# EAGLE schematic 4ButtonSwitch.Rev2.1 (EAGLE 8.6.0)
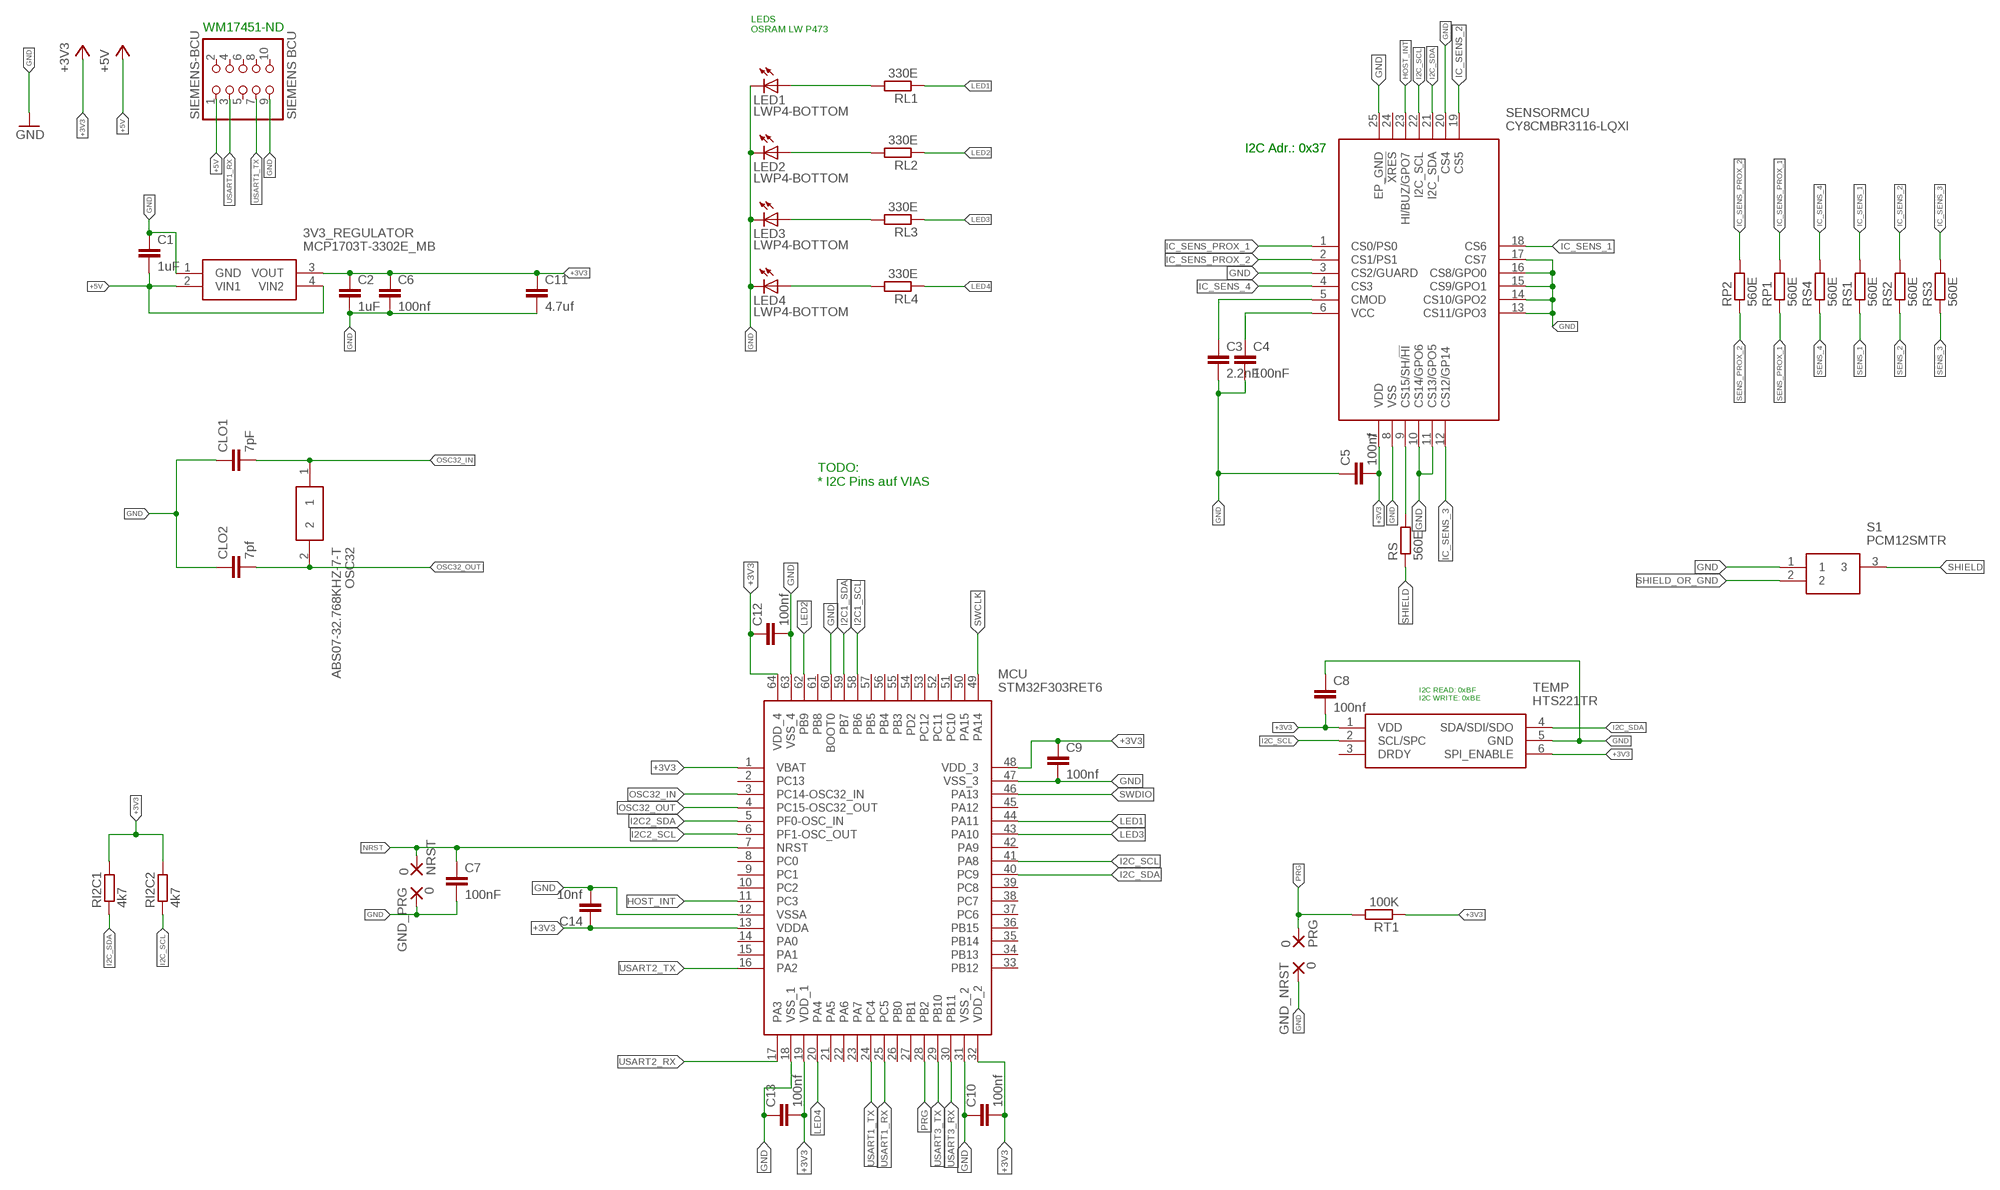
[diagram p0: schematic, sheet 1]

## Parts
3V3_REGULATOR  MCP1703T-3302E_MB  [SOT-89(MB)]
C1  1uF  C-EUC0402  [C0402]
C2  1uF  C-EUC0402  [C0402]
C3  2.2nF  C-EUC0402  [C0402]
C4  100nF  C-EUC0402  [C0402]
C5  100nf  C-EUC0402  [C0402]
C6  100nf  C-EUC0402  [C0402]
C7  100nF  C-EUC0402  [C0402]
C8  100nf  C-EUC0402  [C0402]
C9  100nf  C-EUC0402  [C0402]
C10  100nf  C-EUC0402  [C0402]
C11  4.7uf  C-EUC0402  [C0402]
C12  100nf  C-EUC0402  [C0402]
C13  100nf  C-EUC0402  [C0402]
C14  10nf  C-EUC0402  [C0402]
CLO1  7pF  C-EUC0402  [C0402]
CLO2  7pf  C-EUC0402  [C0402]
GND_NRST  0  SMD5  [SMD2,54-5,08]
GND_PRG  0  SMD5  [SMD2,54-5,08]
LED1  LWP4-BOTTOM  [P47F-BOTTOM]
LED2  LWP4-BOTTOM  [P47F-BOTTOM]
LED3  LWP4-BOTTOM  [P47F-BOTTOM]
LED4  LWP4-BOTTOM  [P47F-BOTTOM]
MCU  STM32F303RET6  [QFP50P1200X1200X160-64N]
NRST  0  SMD5  [SMD2,54-5,08]
OSC32  ABS07-32.768KHZ-7-T  [ABS-07]
PRG  0  SMD5  [SMD2,54-5,08]
RI2C1  4k7  R-EU_R0402  [R0402]
RI2C2  4k7  R-EU_R0402  [R0402]
RL1  330E  R-EU_R0402  [R0402]
RL2  330E  R-EU_R0402  [R0402]
RL3  330E  R-EU_R0402  [R0402]
RL4  330E  R-EU_R0402  [R0402]
RP1  560E  R-EU_R0402  [R0402]
RP2  560E  R-EU_R0402  [R0402]
RS  560E  R-EU_R0402  [R0402]
RS1  560E  R-EU_R0402  [R0402]
RS2  560E  R-EU_R0402  [R0402]
RS3  560E  R-EU_R0402  [R0402]
RS4  560E  R-EU_R0402  [R0402]
RT1  100K  R-EU_R0402  [R0402]
S1  PCM12SMTR  [PCM12SMTR_1]
SENSORMCU  CY8CMBR3116-LQXI  [QFN50P400X400X60-25N]
SIEMENS-BCU  SIEMENS BCU  PINHD-2X5_2.54-SMD  [2X05SMD]
TEMP  HTS221TR  [HLGA-6L]

## Nets
+3V3: 3V3_REGULATOR.3(VOUT) C2.1 C5.2 C6.1 C8.2 C9.1 C10.2 C11.1 C12.1 C13.2 C14.1 MCU.1(VBAT) MCU.13(VDDA) MCU.19(VDD_1) MCU.32(VDD_2) MCU.48(VDD_3) MCU.64(VDD_4) RI2C1.2 RI2C2.2 RT1.1 SENSORMCU.7(VDD) TEMP.1(VDD) TEMP.6(SPI_ENABLE)
+5V: 3V3_REGULATOR.2(VIN1) 3V3_REGULATOR.4(VIN2) C1.2 SIEMENS-BCU.1
CMOD: C3.1 SENSORMCU.5(CMOD)
GND: 3V3_REGULATOR.1(GND) C1.1 C2.2 C3.2 C4.2 C5.1 C6.2 C7.2 C8.1 C9.2 C10.1 C11.2 C12.2 C13.1 C14.2 CLO1.1 CLO2.1 GND_NRST.1(P) GND_PRG.1(P) LED1.C LED2.C LED3.C LED4.C MCU.12(VSSA) MCU.18(VSS_1) MCU.31(VSS_2) MCU.47(VSS_3) MCU.60(BOOT0) MCU.63(VSS_4) S1.1 SENSORMCU.3(CS2/GUARD) SENSORMCU.8(VSS) SENSORMCU.10(CS14/GPO6) SENSORMCU.11(CS13/GPO5) SENSORMCU.13(CS11/GPO3) SENSORMCU.14(CS10/GPO2) SENSORMCU.15(CS9/GPO1) SENSORMCU.16(CS8/GPO0) SENSORMCU.17(CS7) SENSORMCU.20(CS4) SENSORMCU.25(EP_GND) SIEMENS-BCU.9 TEMP.5(GND)
HOST_INT: MCU.11(PC3) SENSORMCU.23(HI/BUZ/GPO7)
I2C1_SCL: MCU.58(PB6)
I2C1_SDA: MCU.59(PB7)
I2C2_SCL: MCU.6(PF1-OSC_OUT)
I2C2_SDA: MCU.5(PF0-OSC_IN)
I2C_SCL: MCU.41(PA8) RI2C2.1 SENSORMCU.22(I2C_SCL) TEMP.2(SCL/SPC)
I2C_SDA: MCU.40(PC9) RI2C1.1 SENSORMCU.21(I2C_SDA) TEMP.4(SDA/SDI/SDO)
IC_SENS_1: RS1.2 SENSORMCU.18(CS6)
IC_SENS_2: RS2.2 SENSORMCU.19(CS5)
IC_SENS_3: RS3.2 SENSORMCU.12(CS12/GP14)
IC_SENS_4: RS4.2 SENSORMCU.4(CS3)
IC_SENS_PROX_1: RP1.2 SENSORMCU.1(CS0/PS0)
IC_SENS_PROX_2: RP2.2 SENSORMCU.2(CS1/PS1)
LED1: MCU.44(PA11) RL1.1
LED2: MCU.62(PB9) RL2.1
LED3: MCU.43(PA10) RL3.1
LED4: MCU.20(PA4) RL4.1
N$1: RS.2 SENSORMCU.9(CS15/SH/!HI)
N$19: LED1.A RL1.2
N$20: LED2.A RL2.2
N$21: LED3.A RL3.2
N$22: LED4.A RL4.2
NRST: C7.1 MCU.7(NRST) NRST.1(P)
OSC32_IN: CLO1.2 MCU.3(PC14-OSC32_IN) OSC32.1
OSC32_OUT: CLO2.2 MCU.4(PC15-OSC32_OUT) OSC32.2
PRG: MCU.28(PB2) PRG.1(P) RT1.2
SENS_1: RS1.1
SENS_2: RS2.1
SENS_3: RS3.1
SENS_4: RS4.1
SENS_PROX_1: RP1.1
SENS_PROX_2: RP2.1
SHIELD: RS.1 S1.3
SHIELD_OR_GND: S1.2
SWCLK: MCU.49(PA14)
SWDIO: MCU.46(PA13)
USART1_RX: MCU.25(PC5) SIEMENS-BCU.3
USART1_TX: MCU.24(PC4) SIEMENS-BCU.7
USART2_RX: MCU.17(PA3)
USART2_TX: MCU.16(PA2)
USART3_RX: MCU.30(PB11)
USART3_TX: MCU.29(PB10)
VCC: C4.1 SENSORMCU.6(VCC)
Unconnected: MCU.2(PC13) MCU.8(PC0) MCU.9(PC1) MCU.10(PC2) MCU.14(PA0) MCU.15(PA1) MCU.21(PA5) MCU.22(PA6) MCU.23(PA7) MCU.26(PB0) MCU.27(PB1) MCU.33(PB12) MCU.34(PB13) MCU.35(PB14) MCU.36(PB15) MCU.37(PC6) MCU.38(PC7) MCU.39(PC8) MCU.42(PA9) MCU.45(PA12) MCU.50(PA15) MCU.51(PC10) MCU.52(PC11) MCU.53(PC12) MCU.54(PD2) MCU.55(PB3) MCU.56(PB4) MCU.57(PB5) MCU.61(PB8) SENSORMCU.24(!XRES) SIEMENS-BCU.2 SIEMENS-BCU.4 SIEMENS-BCU.5 SIEMENS-BCU.6 SIEMENS-BCU.8 SIEMENS-BCU.10 TEMP.3(DRDY)

## Notes on the sheet
- LEDS
  OSRAM LW P473
- WM17451-ND
- I2C Adr.: 0x37 | I2C Adr.: 0x37
- TODO:
  * I2C Pins auf VIAS
- I2C READ: 0xBF
  I2C WRITE: 0xBE

## Library data of the parts
3V3_REGULATOR = MCP1703T-3302E_MB:MCP1703T-3302E_MB: LDO Low Iq 250mA 16V 3.3V 2% SOT89 Microchip MCP1703T-3302E/MB, LDO Voltage Regulator, 250mA, 3.3 V 2%, 2.7 16 Vin, 3-Pin SOT-89 Source: Datasheet <http://ww1.microchip.com/downloads/en/DeviceDoc/22049f.pdf>; ALLIED_NUMBER: 70047986; ALLIED_PRICE/STOCK: https://www.alliedelec.com/microchip-technology-inc-mcp1703t-3302e-mb/70047986/; ARROW_PART_NUMBER: MCP1703T-3302E/MB; ARROW_PRICE/STOCK: https://www.arrow.com/en/products/mcp1703t-3302emb/microchip-technology; DESCRIPTION: LDO Low Iq 250mA 16V 3.3V 2% SOT89 Microchip MCP1703T-3302E/MB, LDO Voltage Regulator, 250mA, 3.3 V 2%, 2.7 16 Vin, 3-Pin SOT-89; HEIGHT: mm; MANUFACTURER_NAME: Microchip; MANUFACTURER_PART_NUMBER: MCP1703T-3302E/MB; RS_PART_NUMBER: 9122916; RS_PRICE/STOCK: http://uk.rs-online.com/web/p/products/9122916
C1-C14 CLO1 CLO2 = rcl:C-EU: CAPACITOR, European symbol; SPICEPREFIX: C
GND_NRST GND_PRG NRST PRG = wirepad:SMD5: SMD PAD
LED1-LED4 = led:*P4: PointLED® Enhanced Thinfilm LED TOP & BOTTOM mount LS P47F, LR P47F, LA P47F, LY P47F, LT P4SG, LB P4SG, LW P4SG Source: http://catalog.osram-os.com .. LA_LR_LS_LY_P47F_Pb_free.pdf
MCU = STM32F303RET6:STM32F303RET6: MCU+FPU 32-Bit Cortex-M4 512KB LQFP64 Source: Datasheet <http://www.st.com/content/ccc/resource/technical/document/datasheet/2c/6f/d7/64/1f/a3/4f/c9/DM00118585.pdf/files/DM00118585.pdf/jcr:content/translations/en.DM00118585.pdf>; ARROW_PART_NUMBER: STM32F303RET6; ARROW_PRICE/STOCK: https://www.arrow.com/en/products/stm32f303ret6/stmicroelectronics; DESCRIPTION: MCU+FPU 32-Bit Cortex-M4 512KB LQFP64; HEIGHT: 1.6mm; MANUFACTURER_NAME: STMicroelectronics; MANUFACTURER_PART_NUMBER: STM32F303RET6; RS_PART_NUMBER: 1458887; RS_PRICE/STOCK: http://uk.rs-online.com/web/p/products/1458887
OSC32 = ABS07-32.768KHZ-7-T:ABS07-32.768KHZ-7-T: ABRACON - ABS07-32.768KHZ-7-T - CRYSTAL, 32.768KHZ, 7PF, SMD Source: Datasheet <https://componentsearchengine.com/Datasheets/2/ABS07-32.768KHZ-7-T.pdf>; ARROW_PART_NUMBER: ABS07-32.768KHZ-7-T; ARROW_PRICE/STOCK: https://www.arrow.com/en/products/abs07-32.768khz-7-t/abracon; DESCRIPTION: ABRACON - ABS07-32.768KHZ-7-T - CRYSTAL, 32.768KHZ, 7PF, SMD; HEIGHT: mm; MANUFACTURER_NAME: ABRACON; MANUFACTURER_PART_NUMBER: ABS07-32.768KHZ-7-T; RS_PART_NUMBER: 1712773P; RS_PRICE/STOCK: http://uk.rs-online.com/web/p/products/1712773P
RI2C1 RI2C2 RL1-RL4 RP1 RP2 RS RS1-RS4 RT1 = resistor:R-EU_: RESISTOR, European symbol
S1 = PCM12SMTR:PCM12SMTR: C & K COMPONENTS - PCM12SMTR - SWITCH, SPDT, 0.3A, 6VDC, SMD Source: Datasheet <http://www.farnell.com/datasheets/1789487.pdf>; ALLIED_NUMBER: 70417448; ALLIED_PRICE/STOCK: https://www.alliedelec.com/c-k-pcm12smtr/70417448/; ARROW_PART_NUMBER: PCM12SMTR; ARROW_PRICE/STOCK: https://www.arrow.com/en/products/pcm12smtr/ck; DESCRIPTION: C & K COMPONENTS - PCM12SMTR - SWITCH, SPDT, 0.3A, 6VDC, SMD; HEIGHT: mm; MANUFACTURER_NAME: C & K COMPONENTS; MANUFACTURER_PART_NUMBER: PCM12SMTR; RS_PART_NUMBER: 7931721P; RS_PRICE/STOCK: http://uk.rs-online.com/web/p/products/7931721P
SENSORMCU = CY8CMBR3116-LQXI:CY8CMBR3116-LQXI: Touch Screen Controllers CapSense Express 16 Buttons Source: Datasheet <http://www.cypress.com/file/46236/download.pdf>; ARROW_PART_NUMBER: CY8CMBR3116-LQXI; ARROW_PRICE/STOCK: https://www.arrow.com/en/products/cy8cmbr3116-lqxi/cypress-semiconductor; DESCRIPTION: Touch Screen Controllers CapSense Express 16 Buttons; HEIGHT: 0.6mm; MANUFACTURER_NAME: Cypress Semiconductor; MANUFACTURER_PART_NUMBER: CY8CMBR3116-LQXI; RS_PART_NUMBER: 1242976P; RS_PRICE/STOCK: http://uk.rs-online.com/web/p/products/1242976P
SIEMENS-BCU = pinhead:PINHD-2X5: PIN HEADER
TEMP = HTS221TR:HTS221TR: Humidity and Temperature Sensor HLGA6 STMicroelectronics HTS221TR Temperature & Humidity Sensor, -40 +120 C, 6-Pin HLGA Source: Datasheet <http://www.st.com/content/ccc/resource/technical/document/datasheet/4d/9a/9c/ad/25/07/42/34/DM00116291.pdf/files/DM00116291.pdf/jcr:content/translations/en.DM00116291.pdf>; ARROW_PART_NUMBER: HTS221TR; ARROW_PRICE/STOCK: https://www.arrow.com/en/products/hts221tr/stmicroelectronics; DESCRIPTION: Humidity and Temperature Sensor HLGA6 STMicroelectronics HTS221TR Temperature & Humidity Sensor, -40 +120 C, 6-Pin HLGA; HEIGHT: mm; MANUFACTURER_NAME: STMicroelectronics; MANUFACTURER_PART_NUMBER: HTS221TR; RS_PART_NUMBER: 1660935; RS_PRICE/STOCK: http://uk.rs-online.com/web/p/products/1660935